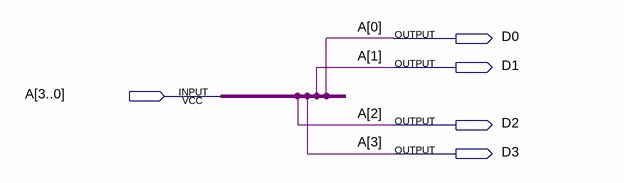
[diagram p0: schematic sheet]
// Quartus schematic adapter_4b_but_to_4p.bdf as structural Verilog: 0 symbols, 5 pins
module adapter_4b_but_to_4p (
  input  [3:0] A,
  output D0,
  output D1,
  output D2,
  output D3
);


  assign D0 = A[0];
  assign D1 = A[1];
  assign D2 = A[2];
  assign D3 = A[3];
endmodule
